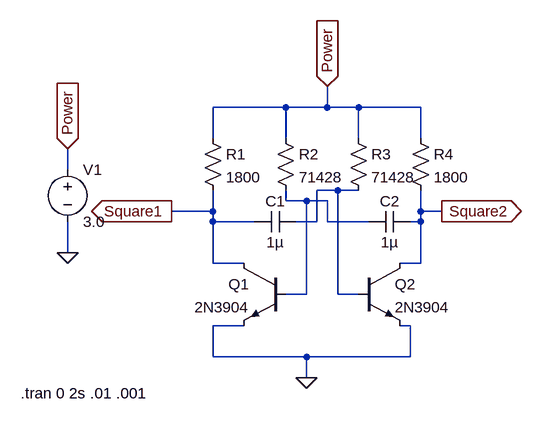
[diagram p0: schematic PWM for flickering.asc]
PWM for flickering.asc, the LTspice schematic file:
Version 4
SHEET 1 880 680
WIRE 352 -144 240 -144
WIRE 416 -144 416 -176
WIRE 416 -144 352 -144
WIRE 464 -144 416 -144
WIRE 560 -144 464 -144
WIRE 240 -96 240 -144
WIRE 352 -96 352 -144
WIRE 464 -96 464 -144
WIRE 560 -96 560 -144
WIRE 16 -48 16 -80
WIRE 432 -16 400 -16
WIRE 464 -16 432 -16
WIRE 352 0 352 -16
WIRE 384 0 352 0
WIRE 416 0 384 0
WIRE 240 16 240 -16
WIRE 240 16 176 16
WIRE 560 16 560 -16
WIRE 592 16 560 16
WIRE 240 32 240 16
WIRE 304 32 240 32
WIRE 400 32 400 -16
WIRE 400 32 368 32
WIRE 416 32 416 0
WIRE 480 32 416 32
WIRE 560 32 560 16
WIRE 560 32 544 32
WIRE 16 80 16 32
WIRE 240 96 240 32
WIRE 288 96 240 96
WIRE 560 96 560 32
WIRE 560 96 528 96
WIRE 384 144 384 0
WIRE 384 144 352 144
WIRE 432 144 432 -16
WIRE 464 144 432 144
WIRE 288 192 240 192
WIRE 544 192 528 192
WIRE 240 240 240 192
WIRE 384 240 240 240
WIRE 544 240 544 192
WIRE 544 240 384 240
WIRE 384 272 384 240
FLAG 16 80 0
FLAG 16 -80 Power
IOPIN 16 -80 In
FLAG 416 -176 Power
IOPIN 416 -176 In
FLAG 176 16 Square1
IOPIN 176 16 Out
FLAG 592 16 Square2
IOPIN 592 16 Out
FLAG 384 272 0
SYMBOL npn 352 96 M0
WINDOW 0 88 32 Right 2
SYMATTR InstName Q1
SYMATTR Value 2N3904
SYMBOL npn 464 96 R0
SYMATTR InstName Q2
SYMATTR Value 2N3904
SYMBOL res 224 -112 R0
SYMATTR InstName R1
SYMATTR Value 1800
SYMBOL res 336 -112 R0
SYMATTR InstName R2
SYMATTR Value 71428
SYMBOL res 448 -112 R0
SYMATTR InstName R3
SYMATTR Value 71428
SYMBOL res 544 -112 R0
SYMATTR InstName R4
SYMATTR Value 1800
SYMBOL cap 304 48 R270
WINDOW 0 32 32 VTop 2
WINDOW 3 0 32 VBottom 2
SYMATTR InstName C1
SYMATTR Value 1µ
SYMBOL cap 480 48 R270
WINDOW 0 32 32 VTop 2
WINDOW 3 0 32 VBottom 2
SYMATTR InstName C2
SYMATTR Value 1µ
SYMBOL voltage 16 -64 R0
WINDOW 123 0 0 Left 0
WINDOW 39 0 0 Left 0
SYMATTR InstName V1
SYMATTR Value 3.0
TEXT -56 296 Left 2 !.tran 0 2s .01 .001

The netlist it stands for:
* PWM for flickering.asc
Q1 Square1 N002 0 0 2N3904
Q2 Square2 N001 0 0 2N3904
R1 Power Square1 1800
R2 Power N002 71428
R3 Power N001 71428
R4 Power Square2 1800
C1 Square1 N001 1µ
C2 N002 Square2 1µ
V1 Power 0 3.0
.model NPN NPN
.model PNP PNP
.lib standard.bjt
.tran 0 2s .01 .001
.backanno
.end